# Altium schematic sheet Communication.SchDoc
size A; SheetNumber: 4; SheetTotal: 5
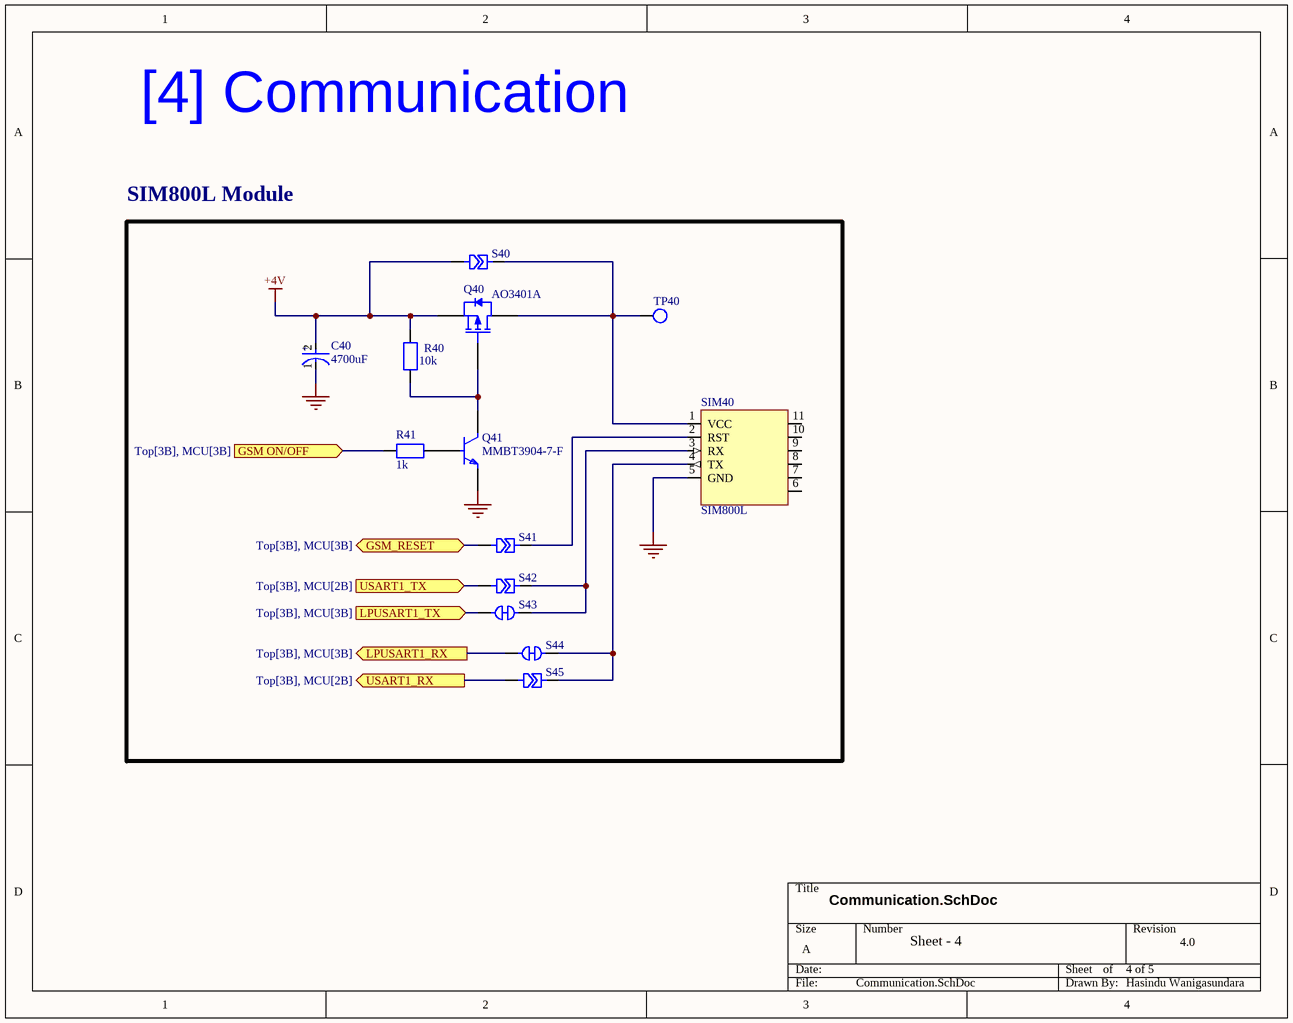
[diagram p0: Communication.SchDoc]

## Parts
C40  4700uF  [FP-RAD-TH-D_12_5_0_5-L_30-MFG]
Q40  AO3401A  [AO-SOT-23-3L_V]
Q41  MMBT3904-7-F  [FP-SOT23-IPC_A]
R40  10k  [RES_1206]
R41  1k  [RES_1206]
S40  Triangular SB  [Solder Bridge Triangular]  (value not drawn)
S41  Triangular SB  [Solder Bridge Triangular]  (value not drawn)
S42  Triangular SB  [Solder Bridge Triangular]  (value not drawn)
S43  Soldering Bridge close  [Circular jumper close]  (value not drawn)  (net tie, no BOM)
S44  Soldering Bridge close  [Circular jumper close]  (value not drawn)  (net tie, no BOM)
S45  Triangular SB  [Solder Bridge Triangular]  (value not drawn)
SIM40  SIM800L  [SIM800L]
TP40  Test Pad  [Test Pad]  (value not drawn)

## Blocks framed on the sheet
SIM800L Module: C40 Q40 Q41 R40 R41 S40-S45 SIM40 TP40

## Ports
GSM ON/OFF (in, see Top[3B], MCU[3B]), GSM_RESET (bidir, see Top[3B], MCU[3B]), LPUSART1_RX (out, see Top[3B], MCU[3B]), LPUSART1_TX (in, see Top[3B], MCU[3B]), USART1_RX (out, see Top[3B], MCU[2B]), USART1_TX (in, see Top[3B], MCU[2B])

## Nets
+4V: C40.2(A) Q40.2(SOURCE) R40.1 S40.1
GND: C40.1(C) Q41.2(E) SIM40.5(GND)
GSM ON/OFF: R41.1 ; port GSM ON/OFF
GSM_RESET: S41.1 ; port GSM_RESET
LPUSART1_RX: S44.1 ; port LPUSART1_RX
LPUSART1_TX: S43.1 ; port LPUSART1_TX
USART1_RX: S45.1 ; port USART1_RX
USART1_TX: S42.1 ; port USART1_TX
NetQ40_1: Q40.1(GATE) Q41.3(C) R40.2
NetQ40_3: Q40.3(DRAIN) S40.2 SIM40.1(VCC) TP40.1
NetQ41_1: Q41.1(B) R41.2
NetS41_2: S41.2 SIM40.2(RST)
NetS42_2: S42.2 S43.2 SIM40.3(RX)
NetS44_2: S44.2 S45.2 SIM40.4(TX)

Not connected (* = marked no-connect by the designer): SIM40 6 7 8 9 10 11

## Notes on the sheet
- [4] Communication
- Communication.SchDoc
- Sheet - 4
- 4 of 5
- 4.0
- Hasindu Wanigasundara
- (in symbol CMP-05427-000691-1) +

## Library data of the parts
C40 = CMP-05427-000691-1: Aluminum Electrolytic Capacitors (Radial Lead Type) AEC-Q200 Qualified 4700uF ±20% 10V
Q40 = CMP-2000-05778-1: P-Channel MOSFET, 30 V, 4 A, -55 to 150 degC, 3-Pin SOT-23-3L, RoHS, Tape and Reel; Manufacturer: Alpha and Omega; Output Power (Max): NotRequiredW; Power Dissipation: 1.4W; Rad Hardened: No; Drain Efficiency: NotRequired%; Drain-Source On-Volt: 30V; Noise Figure: NotRequireddB; Frequency (Max): NotRequiredMHz; Number of  Elements: 1; Gate-Source Voltage (Max): ?12V; Drain Current (Max): 4A; Channel Mode: Enhancement; Drain-Source On-Res: 0.044ohm; Type: PowerMOSFET; Polarity: P; Package URL: http://www.aosmd.com/res/packaging_information/SOT-23-3L.pdf; Datasheet URL: http://www.aosmd.com/res/data_sheets/AO3401A.pdf; Package Type: SOT-23; Package Description: 3-Pin Small Outline Transistor, Body 2.95 x 1.6 mm, Pitch 0.95 mm; Mounting: SurfaceMount; Manufacturer URL: http://www.aosmd.com/; Continuous Drain Current: 4A; Package Reference: SOT-23-3L; Mounting Technology: SurfaceMount; Operating Temperature Classification: Military; Power Gain: NotRequireddB; Datasheet Version: Rev. 3, 03/2011; Operating Temp Range: -55Cto150C; Pin Count: 3
Q41 = CMP-2000-04931-2: TRANS NPN 40V 0.2A SMD SOT23-3; Frequency: 300MHz; Power Dissipation: 350mW; Element Configuration: Single; Max Power Dissipation: 300mW; Max Collector Current: 200mA; Collector Emitter Saturation Voltage: 300mV; Number of Elements: 1; hFE Min: 100; Collector Base Voltage (VCBO): 60V; Emitter Base Voltage (VEBO): 6V; Contact Plating: Tin; Package Quantity: 3000; Max Frequency: 300MHz; REACH SVHC: No SVHC; Max Operating Temperature: 150°C; Width: 1.4mm; Collector Emitter Voltage (VCEO): 40V; Voltage Rating (DC): 40V; Radiation Hardening: No; Case/Package: SOT-23; Height: 1mm; Collector Emitter Breakdown Voltage: 40V; Length: 3.05mm; Polarity: NPN; Packaging: Tape and Reel; Number of Pins: 3; Min Operating Temperature: -55°C; Gain Bandwidth Product: 300MHz; Mount: Surface Mount; Weight: 0.000282oz; Continuous Collector Current: 200mA; Transition Frequency: 300MHz; Max Breakdown Voltage: 40V; Lead Free: Lead Free
R40 R41 = RES_1206: SMD 3.2mm × 1.6mm size resistor (1206); Manufacturer: *; Manufacturer part number: *
S40-S42 S45 = Triangular SB: Solder Bridge triangular closed
S43 S44 = Soldering Bridge close: Soldering Bridge close SMD
SIM40 = SIM800L: SIM800L through hole gsm module